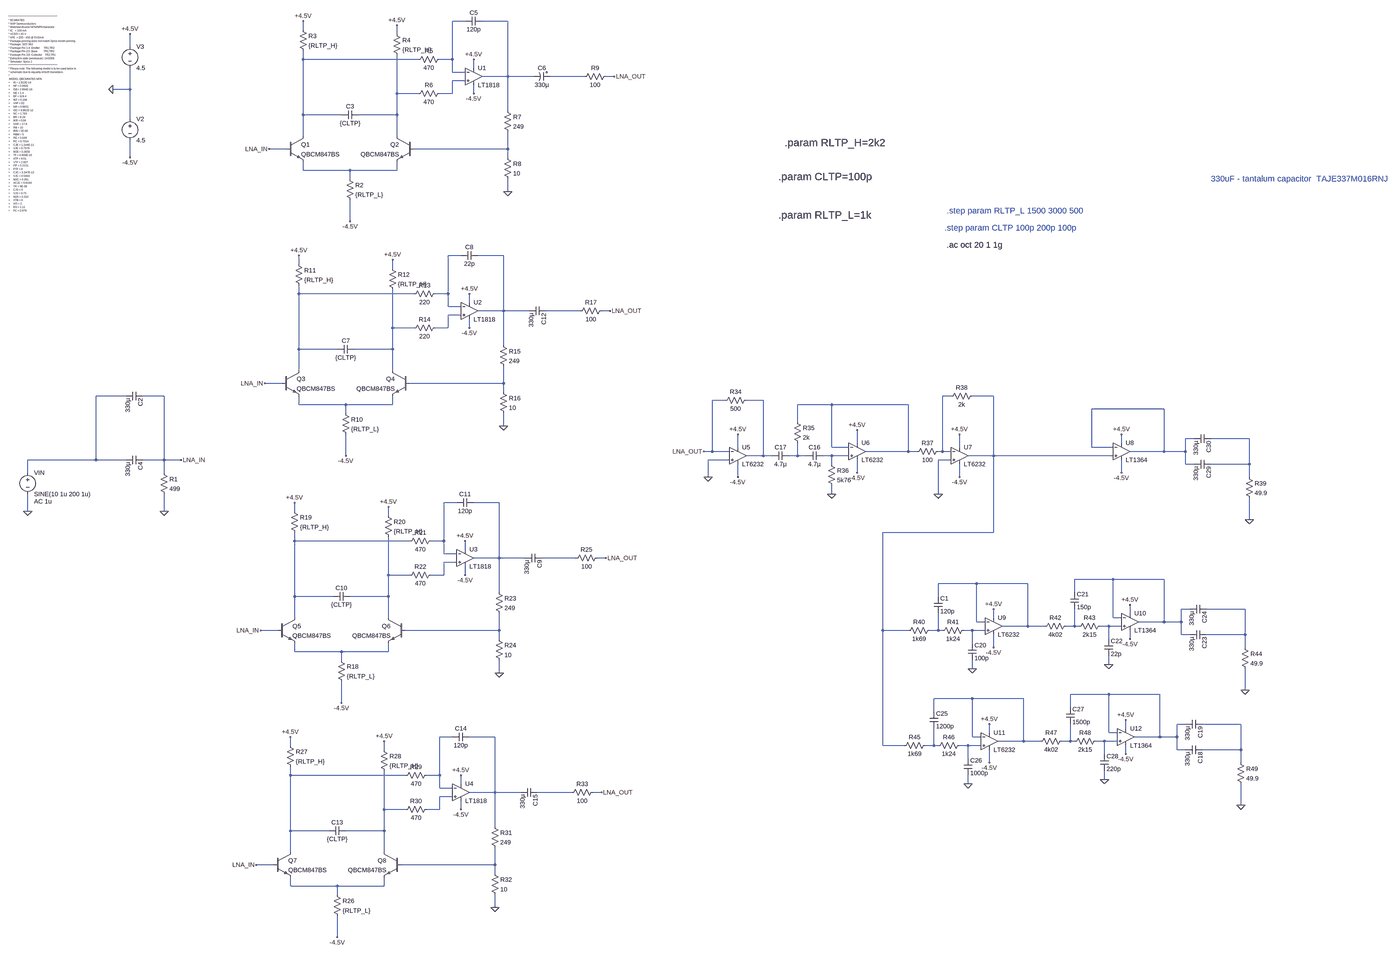
[diagram p0: schematic inzynierka.asc, whole sheet]
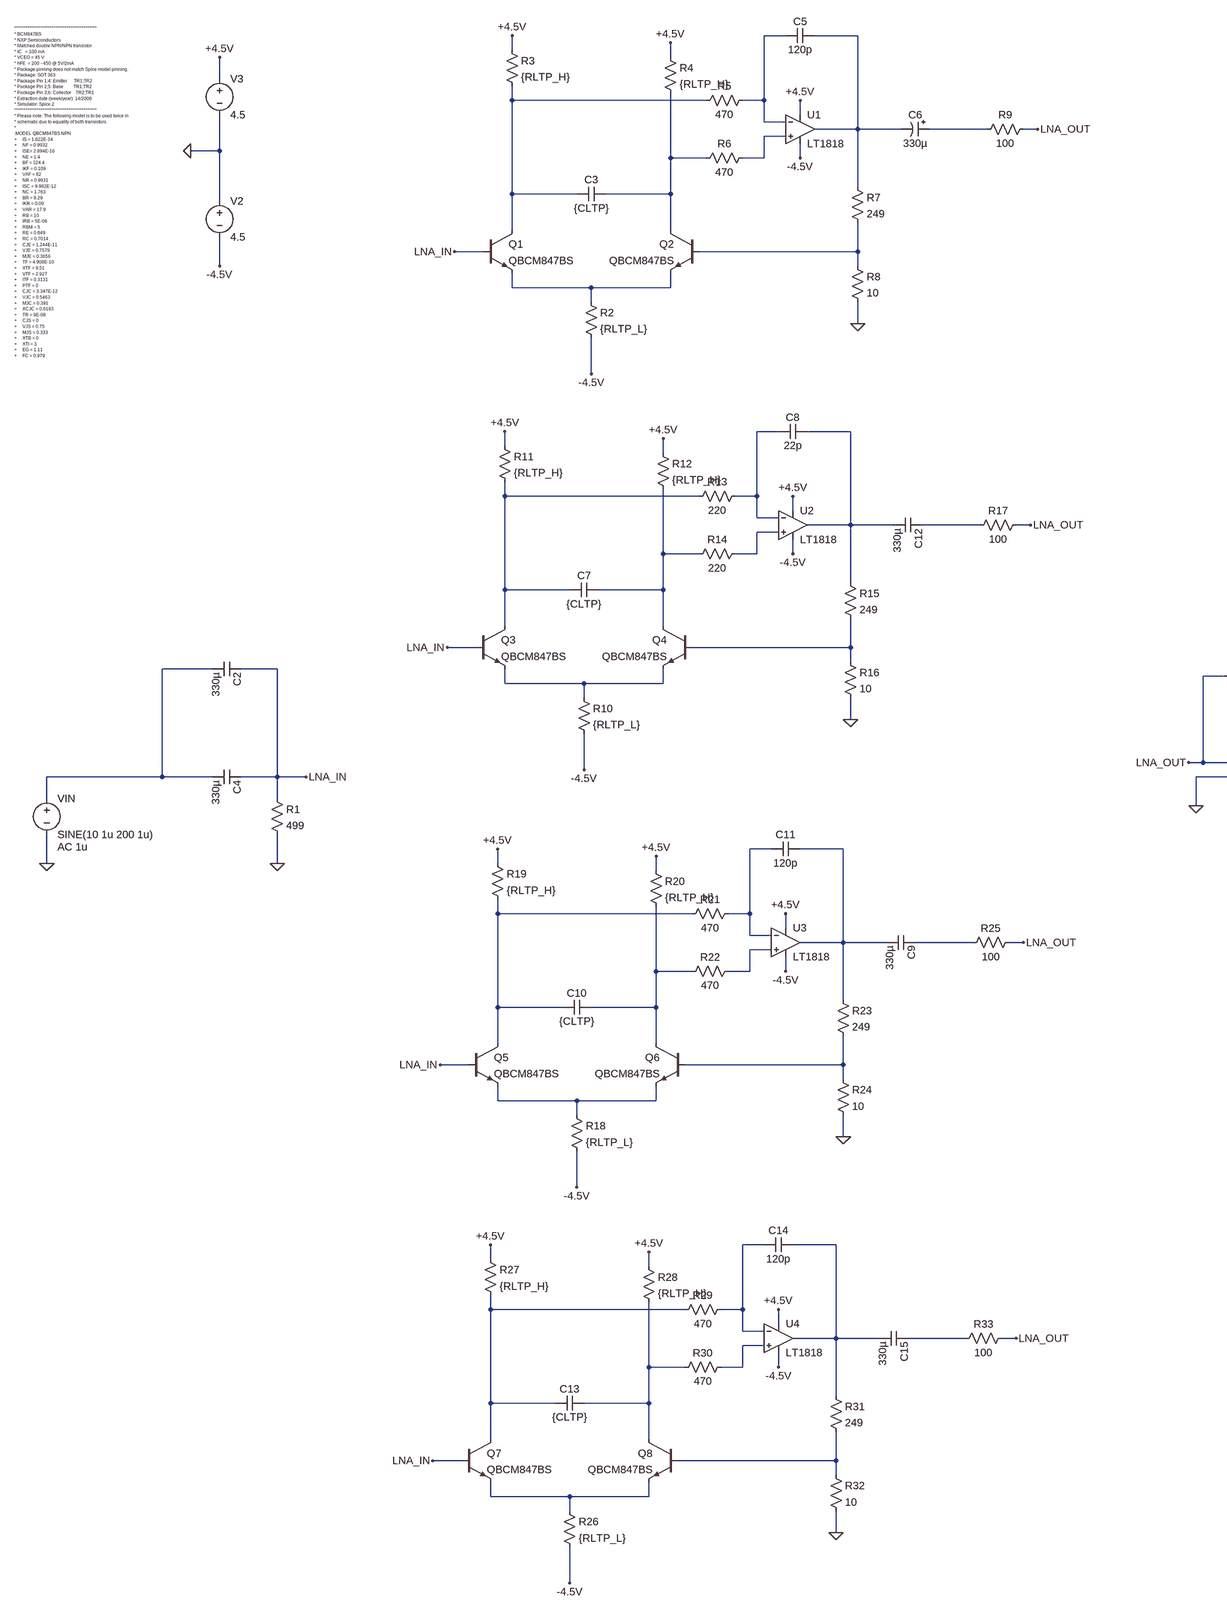
[diagram p1: schematic inzynierka.asc, part, row 1 of 1, column 1 of 2]
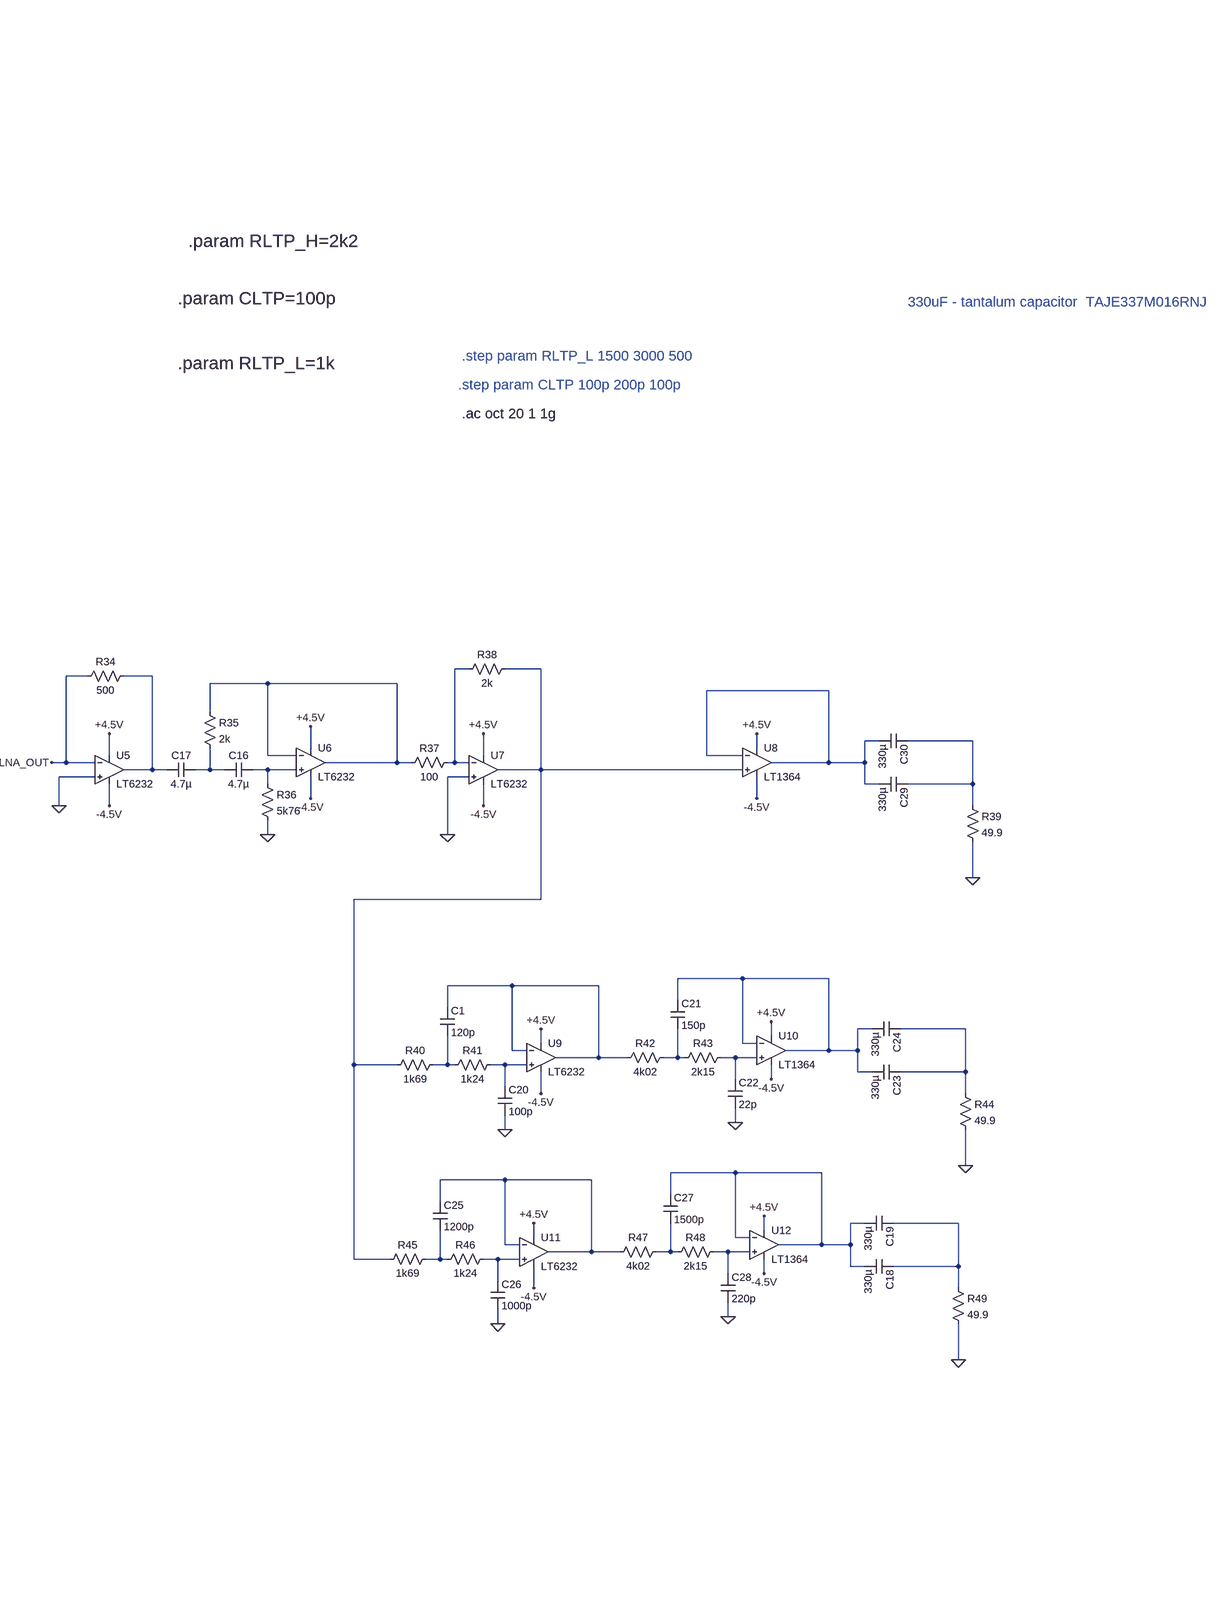
[diagram p2: schematic inzynierka.asc, part, row 1 of 1, column 2 of 2]
inzynierka.asc, the LTspice schematic file:
Version 4
SHEET 1 4992 2584
WIRE 1424 -960 1376 -960
WIRE 1584 -960 1488 -960
WIRE 816 -928 816 -960
WIRE 1168 -912 1168 -944
WIRE -144 -864 -144 -912
WIRE 816 -816 816 -848
WIRE 1248 -816 816 -816
WIRE 1376 -816 1376 -960
WIRE 1376 -816 1328 -816
WIRE 1456 -784 1456 -816
WIRE 1376 -768 1376 -816
WIRE 1424 -768 1376 -768
WIRE 1584 -752 1584 -960
WIRE 1584 -752 1488 -752
WIRE 1680 -752 1584 -752
WIRE 1872 -752 1744 -752
WIRE 1984 -752 1952 -752
WIRE 1424 -736 1376 -736
WIRE -144 -704 -144 -784
WIRE -144 -704 -208 -704
WIRE 1168 -688 1168 -832
WIRE 1248 -688 1168 -688
WIRE 1376 -688 1376 -736
WIRE 1376 -688 1328 -688
WIRE 1456 -688 1456 -720
WIRE 1584 -624 1584 -752
WIRE 816 -608 816 -816
WIRE 960 -608 816 -608
WIRE 1168 -608 1168 -688
WIRE 1168 -608 1024 -608
WIRE -144 -592 -144 -704
WIRE 816 -528 816 -608
WIRE 1168 -528 1168 -608
WIRE 752 -480 688 -480
WIRE 1584 -480 1584 -544
WIRE 1584 -480 1232 -480
WIRE -144 -448 -144 -512
WIRE 1584 -448 1584 -480
WIRE 816 -400 816 -432
WIRE 992 -400 816 -400
WIRE 1168 -400 1168 -432
WIRE 1168 -400 992 -400
WIRE 992 -368 992 -400
WIRE 1584 -320 1584 -368
WIRE 992 -208 992 -288
WIRE 1408 -80 1360 -80
WIRE 1568 -80 1472 -80
WIRE 800 -48 800 -80
WIRE 1152 -32 1152 -64
WIRE 800 64 800 32
WIRE 1232 64 800 64
WIRE 1360 64 1360 -80
WIRE 1360 64 1312 64
WIRE 1440 96 1440 64
WIRE 1360 112 1360 64
WIRE 1408 112 1360 112
WIRE 1568 128 1568 -80
WIRE 1568 128 1472 128
WIRE 1664 128 1568 128
WIRE 1856 128 1728 128
WIRE 1968 128 1936 128
WIRE 1408 144 1360 144
WIRE 1152 192 1152 48
WIRE 1232 192 1152 192
WIRE 1360 192 1360 144
WIRE 1360 192 1312 192
WIRE 1440 192 1440 160
WIRE 1568 256 1568 128
WIRE 800 272 800 64
WIRE 944 272 800 272
WIRE 1152 272 1152 192
WIRE 1152 272 1008 272
WIRE 800 352 800 272
WIRE 1152 352 1152 272
WIRE 736 400 672 400
WIRE 1568 400 1568 336
WIRE 1568 400 1216 400
WIRE 1568 432 1568 400
WIRE -160 448 -272 448
WIRE -16 448 -96 448
WIRE 3296 448 3264 448
WIRE 3456 448 3376 448
WIRE 2448 464 2400 464
WIRE 2592 464 2528 464
WIRE 800 480 800 448
WIRE 976 480 800 480
WIRE 1152 480 1152 448
WIRE 1152 480 976 480
WIRE 2848 480 2720 480
WIRE 3136 480 2848 480
WIRE 4096 496 3824 496
WIRE 976 512 976 480
WIRE 2720 544 2720 480
WIRE 1568 560 1568 512
WIRE 4208 608 4176 608
WIRE 4416 608 4272 608
WIRE 2944 624 2944 576
WIRE 3936 624 3936 592
WIRE 2496 640 2496 592
WIRE 2848 640 2848 480
WIRE 2912 640 2848 640
WIRE 3328 640 3328 592
WIRE 3824 640 3824 496
WIRE 3904 640 3824 640
WIRE 2400 656 2400 464
WIRE 2400 656 2368 656
WIRE 2464 656 2400 656
WIRE 3136 656 3136 480
WIRE 3136 656 2976 656
WIRE 3168 656 3136 656
WIRE 3264 656 3264 448
WIRE 3264 656 3248 656
WIRE 3296 656 3264 656
WIRE 4096 656 4096 496
WIRE 4096 656 3968 656
WIRE 4176 656 4176 608
WIRE 4176 656 4096 656
WIRE 976 672 976 592
WIRE 2592 672 2592 464
WIRE 2592 672 2528 672
WIRE 2624 672 2592 672
WIRE 2720 672 2720 624
WIRE 2720 672 2688 672
WIRE 2752 672 2720 672
WIRE 2848 672 2816 672
WIRE 2912 672 2848 672
WIRE 3456 672 3456 448
WIRE 3456 672 3360 672
WIRE 3904 672 3456 672
WIRE -272 688 -272 448
WIRE -272 688 -528 688
WIRE -160 688 -272 688
WIRE -16 688 -16 448
WIRE -16 688 -96 688
WIRE 48 688 -16 688
WIRE 2464 688 2384 688
WIRE 3296 688 3248 688
WIRE 2848 704 2848 672
WIRE 4176 704 4176 656
WIRE 4208 704 4176 704
WIRE 4416 704 4416 608
WIRE 4416 704 4272 704
WIRE -528 736 -528 688
WIRE -16 736 -16 688
WIRE 2944 736 2944 688
WIRE 3936 736 3936 688
WIRE 2384 752 2384 688
WIRE 2496 752 2496 704
WIRE 3328 752 3328 704
WIRE 4416 752 4416 704
WIRE 2848 816 2848 784
WIRE 3248 816 3248 688
WIRE 1392 848 1344 848
WIRE 1552 848 1456 848
WIRE -528 880 -528 816
WIRE -16 880 -16 816
WIRE 784 880 784 848
WIRE 1136 896 1136 864
WIRE 4416 912 4416 832
WIRE 3456 960 3456 672
WIRE 3456 960 3040 960
WIRE 784 992 784 960
WIRE 1216 992 784 992
WIRE 1344 992 1344 848
WIRE 1344 992 1296 992
WIRE 1424 1024 1424 992
WIRE 1344 1040 1344 992
WIRE 1392 1040 1344 1040
WIRE 1552 1056 1552 848
WIRE 1552 1056 1456 1056
WIRE 1648 1056 1552 1056
WIRE 1840 1056 1712 1056
WIRE 1952 1056 1920 1056
WIRE 1392 1072 1344 1072
WIRE 1136 1120 1136 976
WIRE 1216 1120 1136 1120
WIRE 1344 1120 1344 1072
WIRE 1344 1120 1296 1120
WIRE 1424 1120 1424 1088
WIRE 3904 1136 3760 1136
WIRE 4096 1136 3904 1136
WIRE 3392 1152 3248 1152
WIRE 3584 1152 3392 1152
WIRE 1552 1184 1552 1056
WIRE 3760 1184 3760 1136
WIRE 784 1200 784 992
WIRE 928 1200 784 1200
WIRE 1136 1200 1136 1120
WIRE 1136 1200 992 1200
WIRE 3248 1200 3248 1152
WIRE 4192 1248 4160 1248
WIRE 4400 1248 4256 1248
WIRE 3968 1264 3968 1232
WIRE 784 1280 784 1200
WIRE 1136 1280 1136 1200
WIRE 3456 1280 3456 1248
WIRE 3904 1280 3904 1136
WIRE 3936 1280 3904 1280
WIRE 3392 1296 3392 1152
WIRE 3424 1296 3392 1296
WIRE 4096 1296 4096 1136
WIRE 4096 1296 4000 1296
WIRE 4160 1296 4160 1248
WIRE 4160 1296 4096 1296
WIRE 3584 1312 3584 1152
WIRE 3584 1312 3488 1312
WIRE 3648 1312 3584 1312
WIRE 3760 1312 3760 1248
WIRE 3760 1312 3728 1312
WIRE 3776 1312 3760 1312
WIRE 3888 1312 3856 1312
WIRE 3936 1312 3888 1312
WIRE 720 1328 656 1328
WIRE 1552 1328 1552 1264
WIRE 1552 1328 1200 1328
WIRE 3040 1328 3040 960
WIRE 3136 1328 3040 1328
WIRE 3248 1328 3248 1264
WIRE 3248 1328 3216 1328
WIRE 3264 1328 3248 1328
WIRE 3376 1328 3344 1328
WIRE 3424 1328 3376 1328
WIRE 4160 1344 4160 1296
WIRE 4192 1344 4160 1344
WIRE 4400 1344 4400 1248
WIRE 4400 1344 4256 1344
WIRE 1552 1360 1552 1328
WIRE 3888 1360 3888 1312
WIRE 3968 1360 3968 1328
WIRE 3376 1376 3376 1328
WIRE 3456 1392 3456 1344
WIRE 4400 1392 4400 1344
WIRE 784 1408 784 1376
WIRE 960 1408 784 1408
WIRE 1136 1408 1136 1376
WIRE 1136 1408 960 1408
WIRE 960 1440 960 1408
WIRE 3888 1456 3888 1424
WIRE 3376 1472 3376 1440
WIRE 1552 1488 1552 1440
WIRE 4400 1552 4400 1472
WIRE 3888 1568 3744 1568
WIRE 4080 1568 3888 1568
WIRE 3376 1584 3232 1584
WIRE 3568 1584 3376 1584
WIRE 960 1600 960 1520
WIRE 3744 1616 3744 1568
WIRE 3232 1632 3232 1584
WIRE 4176 1680 4144 1680
WIRE 4384 1680 4240 1680
WIRE 3952 1696 3952 1664
WIRE 3440 1712 3440 1680
WIRE 3888 1712 3888 1568
WIRE 3920 1712 3888 1712
WIRE 1376 1728 1328 1728
WIRE 1536 1728 1440 1728
WIRE 3376 1728 3376 1584
WIRE 3408 1728 3376 1728
WIRE 4080 1728 4080 1568
WIRE 4080 1728 3984 1728
WIRE 4144 1728 4144 1680
WIRE 4144 1728 4080 1728
WIRE 3568 1744 3568 1584
WIRE 3568 1744 3472 1744
WIRE 3632 1744 3568 1744
WIRE 3744 1744 3744 1680
WIRE 3744 1744 3712 1744
WIRE 3760 1744 3744 1744
WIRE 3872 1744 3840 1744
WIRE 3920 1744 3872 1744
WIRE 768 1760 768 1728
WIRE 3040 1760 3040 1328
WIRE 3120 1760 3040 1760
WIRE 3232 1760 3232 1696
WIRE 3232 1760 3200 1760
WIRE 3248 1760 3232 1760
WIRE 3360 1760 3328 1760
WIRE 3408 1760 3360 1760
WIRE 1120 1776 1120 1744
WIRE 4144 1776 4144 1728
WIRE 4176 1776 4144 1776
WIRE 4384 1776 4384 1680
WIRE 4384 1776 4240 1776
WIRE 3872 1792 3872 1744
WIRE 3952 1792 3952 1760
WIRE 3360 1808 3360 1760
WIRE 3440 1824 3440 1776
WIRE 4384 1824 4384 1776
WIRE 768 1872 768 1840
WIRE 1200 1872 768 1872
WIRE 1328 1872 1328 1728
WIRE 1328 1872 1280 1872
WIRE 3872 1888 3872 1856
WIRE 1408 1904 1408 1872
WIRE 3360 1904 3360 1872
WIRE 1328 1920 1328 1872
WIRE 1376 1920 1328 1920
WIRE 1536 1936 1536 1728
WIRE 1536 1936 1440 1936
WIRE 1632 1936 1536 1936
WIRE 1824 1936 1696 1936
WIRE 1936 1936 1904 1936
WIRE 1376 1952 1328 1952
WIRE 4384 1984 4384 1904
WIRE 1120 2000 1120 1856
WIRE 1200 2000 1120 2000
WIRE 1328 2000 1328 1952
WIRE 1328 2000 1280 2000
WIRE 1408 2000 1408 1968
WIRE 1536 2064 1536 1936
WIRE 768 2080 768 1872
WIRE 912 2080 768 2080
WIRE 1120 2080 1120 2000
WIRE 1120 2080 976 2080
WIRE 768 2160 768 2080
WIRE 1120 2160 1120 2080
WIRE 704 2208 640 2208
WIRE 1536 2208 1536 2144
WIRE 1536 2208 1184 2208
WIRE 1536 2240 1536 2208
WIRE 768 2288 768 2256
WIRE 944 2288 768 2288
WIRE 1120 2288 1120 2256
WIRE 1120 2288 944 2288
WIRE 944 2320 944 2288
WIRE 1536 2368 1536 2320
WIRE 944 2480 944 2400
FLAG -528 880 0
FLAG -16 880 0
FLAG -208 -704 0
FLAG -144 -912 +4.5V
FLAG -144 -448 -4.5V
FLAG 992 -208 -4.5V
FLAG 816 -960 +4.5V
FLAG 1168 -944 +4.5V
FLAG 1456 -816 +4.5V
FLAG 1456 -688 -4.5V
FLAG 1584 -320 0
FLAG 1984 -752 LNA_OUT
FLAG 688 -480 LNA_IN
FLAG 48 688 LNA_IN
FLAG 976 672 -4.5V
FLAG 800 -80 +4.5V
FLAG 1152 -64 +4.5V
FLAG 1440 64 +4.5V
FLAG 1440 192 -4.5V
FLAG 1568 560 0
FLAG 1968 128 LNA_OUT
FLAG 672 400 LNA_IN
FLAG 960 1600 -4.5V
FLAG 784 848 +4.5V
FLAG 1136 864 +4.5V
FLAG 1424 992 +4.5V
FLAG 1424 1120 -4.5V
FLAG 1552 1488 0
FLAG 1952 1056 LNA_OUT
FLAG 656 1328 LNA_IN
FLAG 944 2480 -4.5V
FLAG 768 1728 +4.5V
FLAG 1120 1744 +4.5V
FLAG 1408 1872 +4.5V
FLAG 1408 2000 -4.5V
FLAG 1536 2368 0
FLAG 1936 1936 LNA_OUT
FLAG 640 2208 LNA_IN
FLAG 2368 656 LNA_OUT
FLAG 2496 592 +4.5V
FLAG 2496 752 -4.5V
FLAG 2944 576 +4.5V
FLAG 2944 736 -4.5V
FLAG 2384 752 0
FLAG 2848 816 0
FLAG 3328 592 +4.5V
FLAG 3328 752 -4.5V
FLAG 3248 816 0
FLAG 3936 736 -4.5V
FLAG 3936 592 +4.5V
FLAG 4416 912 0
FLAG 3376 1472 0
FLAG 3888 1456 0
FLAG 4400 1552 0
FLAG 3456 1248 +4.5V
FLAG 3968 1232 +4.5V
FLAG 3968 1360 -4.5V
FLAG 3456 1392 -4.5V
FLAG 3360 1904 0
FLAG 3872 1888 0
FLAG 4384 1984 0
FLAG 3440 1680 +4.5V
FLAG 3952 1664 +4.5V
FLAG 3952 1792 -4.5V
FLAG 3440 1824 -4.5V
SYMBOL voltage -528 720 R0
WINDOW 123 24 124 Left 2
WINDOW 39 0 0 Left 0
SYMATTR Value2 AC 1u
SYMATTR InstName VIN
SYMATTR Value SINE(10 1u 200 1u)
SYMBOL res -32 720 R0
SYMATTR InstName R1
SYMATTR Value 499
SYMATTR SpiceLine tol=1 pwr=0.1
SYMBOL npn 752 -528 R0
SYMATTR InstName Q1
SYMATTR Value QBCM847BS
SYMBOL npn 1232 -528 M0
SYMATTR InstName Q2
SYMATTR Value QBCM847BS
SYMBOL res 976 -384 R0
SYMATTR InstName R2
SYMATTR Value {RLTP_L}
SYMATTR SpiceLine tol=1 pwr=0.1
SYMBOL cap 1024 -624 R90
WINDOW 0 0 32 VBottom 2
WINDOW 3 32 32 VTop 2
SYMATTR InstName C3
SYMATTR Value {CLTP}
SYMATTR SpiceLine V=50 Irms=0 Rser=0 Lser=0 mfg="Murata" pn="GCM1555C1H331JA16" type="C0G"
SYMBOL res 800 -944 R0
SYMATTR InstName R3
SYMATTR Value {RLTP_H}
SYMATTR SpiceLine tol=1 pwr=0.1
SYMBOL res 1152 -928 R0
SYMATTR InstName R4
SYMATTR Value {RLTP_H}
SYMATTR SpiceLine tol=1 pwr=0.1
SYMBOL voltage -144 -608 R0
WINDOW 123 0 0 Left 0
WINDOW 39 0 0 Left 0
SYMATTR InstName V2
SYMATTR Value 4.5
SYMBOL voltage -144 -880 R0
WINDOW 123 0 0 Left 0
WINDOW 39 0 0 Left 0
SYMATTR InstName V3
SYMATTR Value 4.5
SYMBOL Opamps\\LT1818 1456 -752 R0
SYMATTR InstName U1
SYMBOL res 1344 -832 R90
WINDOW 0 0 56 VBottom 2
WINDOW 3 32 56 VTop 2
SYMATTR InstName R5
SYMATTR Value 470
SYMATTR SpiceLine tol=1 pwr=0.1
SYMBOL res 1344 -704 R90
WINDOW 0 0 56 VBottom 2
WINDOW 3 32 56 VTop 2
SYMATTR InstName R6
SYMATTR Value 470
SYMATTR SpiceLine tol=1 pwr=0.1
SYMBOL cap 1488 -976 R90
WINDOW 0 0 32 VBottom 2
WINDOW 3 32 32 VTop 2
SYMATTR InstName C5
SYMATTR Value 120p
SYMATTR SpiceLine V=50 Irms=0 Rser=0 Lser=0 mfg="Murata" pn="GRM0335C1H121JA01" type="C0G"
SYMBOL res 1568 -640 R0
SYMATTR InstName R7
SYMATTR Value 249
SYMATTR SpiceLine tol=1 pwr=0.1
SYMBOL res 1568 -464 R0
SYMATTR InstName R8
SYMATTR Value 10
SYMATTR SpiceLine tol=1 pwr=0.1
SYMBOL polcap 1744 -768 R90
WINDOW 0 0 32 VBottom 2
WINDOW 3 32 32 VTop 2
SYMATTR InstName C6
SYMATTR Value 330µ
SYMATTR Description Capacitor
SYMATTR Type cap
SYMATTR SpiceLine V=16 Irms=2.22261 Rser=0.05 Lser=0 mfg="KEMET" pn="T521X337M016ATE050" type="Tantalum"
SYMBOL res 1968 -768 R90
WINDOW 0 0 56 VBottom 2
WINDOW 3 32 56 VTop 2
SYMATTR InstName R9
SYMATTR Value 100
SYMATTR SpiceLine tol=1 pwr=0.1
SYMBOL npn 736 352 R0
SYMATTR InstName Q3
SYMATTR Value QBCM847BS
SYMBOL npn 1216 352 M0
SYMATTR InstName Q4
SYMATTR Value QBCM847BS
SYMBOL res 960 496 R0
SYMATTR InstName R10
SYMATTR Value {RLTP_L}
SYMATTR SpiceLine tol=1 pwr=0.1
SYMBOL cap 1008 256 R90
WINDOW 0 0 32 VBottom 2
WINDOW 3 32 32 VTop 2
SYMATTR InstName C7
SYMATTR Value {CLTP}
SYMATTR SpiceLine V=50 Irms=0 Rser=0 Lser=0
SYMBOL res 784 -64 R0
SYMATTR InstName R11
SYMATTR Value {RLTP_H}
SYMATTR SpiceLine tol=1 pwr=0.1
SYMBOL res 1136 -48 R0
SYMATTR InstName R12
SYMATTR Value {RLTP_H}
SYMATTR SpiceLine tol=1 pwr=0.1
SYMBOL Opamps\\LT1818 1440 128 R0
SYMATTR InstName U2
SYMBOL res 1328 48 R90
WINDOW 0 0 56 VBottom 2
WINDOW 3 32 56 VTop 2
SYMATTR InstName R13
SYMATTR Value 220
SYMATTR SpiceLine tol=1 pwr=0.1
SYMBOL res 1328 176 R90
WINDOW 0 0 56 VBottom 2
WINDOW 3 32 56 VTop 2
SYMATTR InstName R14
SYMATTR Value 220
SYMATTR SpiceLine tol=1 pwr=0.1
SYMBOL cap 1472 -96 R90
WINDOW 0 0 32 VBottom 2
WINDOW 3 32 32 VTop 2
SYMATTR InstName C8
SYMATTR Value 22p
SYMATTR SpiceLine V=50 Irms=0 Rser=0 Lser=0
SYMBOL res 1552 240 R0
SYMATTR InstName R15
SYMATTR Value 249
SYMATTR SpiceLine tol=1 pwr=0.1
SYMBOL res 1552 416 R0
SYMATTR InstName R16
SYMATTR Value 10
SYMATTR SpiceLine tol=1 pwr=0.1
SYMBOL res 1952 112 R90
WINDOW 0 0 56 VBottom 2
WINDOW 3 32 56 VTop 2
SYMATTR InstName R17
SYMATTR Value 100
SYMATTR SpiceLine tol=1 pwr=0.1
SYMBOL npn 720 1280 R0
SYMATTR InstName Q5
SYMATTR Value QBCM847BS
SYMBOL npn 1200 1280 M0
SYMATTR InstName Q6
SYMATTR Value QBCM847BS
SYMBOL res 944 1424 R0
SYMATTR InstName R18
SYMATTR Value {RLTP_L}
SYMATTR SpiceLine tol=1 pwr=0.1
SYMBOL cap 992 1184 R90
WINDOW 0 0 32 VBottom 2
WINDOW 3 32 32 VTop 2
SYMATTR InstName C10
SYMATTR Value {CLTP}
SYMATTR SpiceLine V=50 Irms=0 Rser=0 Lser=0 mfg="Murata" pn="GCM1555C1H331JA16" type="C0G"
SYMBOL res 768 864 R0
SYMATTR InstName R19
SYMATTR Value {RLTP_H}
SYMATTR SpiceLine tol=1 pwr=0.1
SYMBOL res 1120 880 R0
SYMATTR InstName R20
SYMATTR Value {RLTP_H}
SYMATTR SpiceLine tol=1 pwr=0.1
SYMBOL Opamps\\LT1818 1424 1056 R0
SYMATTR InstName U3
SYMBOL res 1312 976 R90
WINDOW 0 0 56 VBottom 2
WINDOW 3 32 56 VTop 2
SYMATTR InstName R21
SYMATTR Value 470
SYMATTR SpiceLine tol=1 pwr=0.1
SYMBOL res 1312 1104 R90
WINDOW 0 0 56 VBottom 2
WINDOW 3 32 56 VTop 2
SYMATTR InstName R22
SYMATTR Value 470
SYMATTR SpiceLine tol=1 pwr=0.1
SYMBOL cap 1456 832 R90
WINDOW 0 0 32 VBottom 2
WINDOW 3 32 32 VTop 2
SYMATTR InstName C11
SYMATTR Value 120p
SYMATTR SpiceLine V=50 Irms=0 Rser=0 Lser=0 mfg="Murata" pn="GRM0335C1H121JA01" type="C0G"
SYMBOL res 1536 1168 R0
SYMATTR InstName R23
SYMATTR Value 249
SYMATTR SpiceLine tol=1 pwr=0.1
SYMBOL res 1536 1344 R0
SYMATTR InstName R24
SYMATTR Value 10
SYMATTR SpiceLine tol=1 pwr=0.1
SYMBOL res 1936 1040 R90
WINDOW 0 0 56 VBottom 2
WINDOW 3 32 56 VTop 2
SYMATTR InstName R25
SYMATTR Value 100
SYMATTR SpiceLine tol=1 pwr=0.1
SYMBOL npn 704 2160 R0
SYMATTR InstName Q7
SYMATTR Value QBCM847BS
SYMBOL npn 1184 2160 M0
SYMATTR InstName Q8
SYMATTR Value QBCM847BS
SYMBOL res 928 2304 R0
SYMATTR InstName R26
SYMATTR Value {RLTP_L}
SYMATTR SpiceLine tol=1 pwr=0.1
SYMBOL cap 976 2064 R90
WINDOW 0 0 32 VBottom 2
WINDOW 3 32 32 VTop 2
SYMATTR InstName C13
SYMATTR Value {CLTP}
SYMATTR SpiceLine V=50 Irms=0 Rser=0 Lser=0 mfg="Murata" pn="GCM1555C1H331JA16" type="C0G"
SYMBOL res 752 1744 R0
SYMATTR InstName R27
SYMATTR Value {RLTP_H}
SYMATTR SpiceLine tol=1 pwr=0.1
SYMBOL res 1104 1760 R0
SYMATTR InstName R28
SYMATTR Value {RLTP_H}
SYMATTR SpiceLine tol=1 pwr=0.1
SYMBOL Opamps\\LT1818 1408 1936 R0
SYMATTR InstName U4
SYMBOL res 1296 1856 R90
WINDOW 0 0 56 VBottom 2
WINDOW 3 32 56 VTop 2
SYMATTR InstName R29
SYMATTR Value 470
SYMATTR SpiceLine tol=1 pwr=0.1
SYMBOL res 1296 1984 R90
WINDOW 0 0 56 VBottom 2
WINDOW 3 32 56 VTop 2
SYMATTR InstName R30
SYMATTR Value 470
SYMATTR SpiceLine tol=1 pwr=0.1
SYMBOL cap 1440 1712 R90
WINDOW 0 0 32 VBottom 2
WINDOW 3 32 32 VTop 2
SYMATTR InstName C14
SYMATTR Value 120p
SYMATTR SpiceLine V=50 Irms=0 Rser=0 Lser=0 mfg="Murata" pn="GRM0335C1H121JA01" type="C0G"
SYMBOL res 1520 2048 R0
SYMATTR InstName R31
SYMATTR Value 249
SYMATTR SpiceLine tol=1 pwr=0.1
SYMBOL res 1520 2224 R0
SYMATTR InstName R32
SYMATTR Value 10
SYMATTR SpiceLine tol=1 pwr=0.1
SYMBOL res 1920 1920 R90
WINDOW 0 0 56 VBottom 2
WINDOW 3 32 56 VTop 2
SYMATTR InstName R33
SYMATTR Value 100
SYMATTR SpiceLine tol=1 pwr=0.1
SYMBOL Opamps\\LT6232 2496 672 R0
SYMATTR InstName U5
SYMBOL Opamps\\LT6232 2944 656 R0
SYMATTR InstName U6
SYMBOL res 2544 448 R90
WINDOW 0 0 56 VBottom 2
WINDOW 3 32 56 VTop 2
SYMATTR InstName R34
SYMATTR Value 500
SYMATTR SpiceLine tol=1 pwr=0.1
SYMBOL cap 2688 656 R90
WINDOW 0 0 32 VBottom 2
WINDOW 3 32 32 VTop 2
SYMATTR InstName C17
SYMATTR Value 4.7µ
SYMATTR SpiceLine V=16 Irms=0 Rser=0 Lser=0 mfg="Murata" pn="GCM31CR71C475MA37" type="X7R"
SYMBOL cap 2816 656 R90
WINDOW 0 0 32 VBottom 2
WINDOW 3 32 32 VTop 2
SYMATTR InstName C16
SYMATTR Value 4.7µ
SYMATTR SpiceLine V=16 Irms=0 Rser=0 Lser=0 mfg="Murata" pn="GCM31CR71C475MA37" type="X7R"
SYMBOL res 2704 528 R0
SYMATTR InstName R35
SYMATTR Value 2k
SYMBOL res 2832 688 R0
SYMATTR InstName R36
SYMATTR Value 5k76
SYMBOL Opamps\\LT6232 3328 672 R0
SYMATTR InstName U7
SYMBOL res 3264 640 R90
WINDOW 0 0 56 VBottom 2
WINDOW 3 32 56 VTop 2
SYMATTR InstName R37
SYMATTR Value 100
SYMATTR SpiceLine tol=1 pwr=0.1
SYMBOL Opamps\\LT1364 3936 592 R0
SYMATTR InstName U8
SYMBOL res 4400 736 R0
SYMATTR InstName R39
SYMATTR Value 49.9
SYMATTR SpiceLine tol=1 pwr=0.1
SYMBOL res 3392 432 R90
WINDOW 0 0 56 VBottom 2
WINDOW 3 32 56 VTop 2
SYMATTR InstName R38
SYMATTR Value 2k
SYMBOL res 3232 1312 R90
WINDOW 0 0 56 VBottom 2
WINDOW 3 32 56 VTop 2
SYMATTR InstName R40
SYMATTR Value 1k69
SYMBOL res 3360 1312 R90
WINDOW 0 0 56 VBottom 2
WINDOW 3 32 56 VTop 2
SYMATTR InstName R41
SYMATTR Value 1k24
SYMBOL cap 3232 1200 R0
SYMATTR InstName C1
SYMATTR Value 120p
SYMBOL Opamps\\LT6232 3456 1312 R0
SYMATTR InstName U9
SYMBOL cap 3360 1376 R0
SYMATTR InstName C20
SYMATTR Value 100p
SYMBOL res 3744 1296 R90
WINDOW 0 0 56 VBottom 2
WINDOW 3 32 56 VTop 2
SYMATTR InstName R42
SYMATTR Value 4k02
SYMBOL res 3872 1296 R90
WINDOW 0 0 56 VBottom 2
WINDOW 3 32 56 VTop 2
SYMATTR InstName R43
SYMATTR Value 2k15
SYMBOL cap 3744 1184 R0
SYMATTR InstName C21
SYMATTR Value 150p
SYMBOL cap 3872 1360 R0
SYMATTR InstName C22
SYMATTR Value 22p
SYMBOL res 4384 1376 R0
SYMATTR InstName R44
SYMATTR Value 49.9
SYMATTR SpiceLine tol=1 pwr=0.1
SYMBOL Opamps\\LT1364 3968 1232 R0
SYMATTR InstName U10
SYMBOL res 3216 1744 R90
WINDOW 0 0 56 VBottom 2
WINDOW 3 32 56 VTop 2
SYMATTR InstName R45
SYMATTR Value 1k69
SYMBOL res 3344 1744 R90
WINDOW 0 0 56 VBottom 2
WINDOW 3 32 56 VTop 2
SYMATTR InstName R46
SYMATTR Value 1k24
SYMBOL cap 3216 1632 R0
SYMATTR InstName C25
SYMATTR Value 1200p
SYMBOL Opamps\\LT6232 3440 1744 R0
SYMATTR InstName U11
SYMBOL cap 3344 1808 R0
SYMATTR InstName C26
SYMATTR Value 1000p
SYMBOL res 3728 1728 R90
WINDOW 0 0 56 VBottom 2
WINDOW 3 32 56 VTop 2
SYMATTR InstName R47
SYMATTR Value 4k02
SYMBOL res 3856 1728 R90
WINDOW 0 0 56 VBottom 2
WINDOW 3 32 56 VTop 2
SYMATTR InstName R48
SYMATTR Value 2k15
SYMBOL cap 3728 1616 R0
SYMATTR InstName C27
SYMATTR Value 1500p
SYMBOL cap 3856 1792 R0
SYMATTR InstName C28
SYMATTR Value 220p
SYMBOL res 4368 1808 R0
SYMATTR InstName R49
SYMATTR Value 49.9
SYMATTR SpiceLine tol=1 pwr=0.1
SYMBOL Opamps\\LT1364 3952 1664 R0
SYMATTR InstName U12
SYMBOL cap -96 432 R90
SYMATTR InstName C2
SYMATTR Value 330µ
SYMATTR SpiceLine V=16 Irms=0.578 Rser=0.4 Lser=2n Rpar=500k
SYMBOL cap -96 672 R90
SYMATTR InstName C4
SYMATTR Value 330µ
SYMATTR SpiceLine V=16 Irms=0.578 Rser=0.4 Lser=2n Rpar=500k
SYMBOL cap 1712 1040 R90
SYMATTR InstName C9
SYMATTR Value 330µ
SYMATTR SpiceLine V=16 Irms=0.578 Rser=0.4 Lser=2n Rpar=500k
SYMBOL cap 1728 112 R90
SYMATTR InstName C12
SYMATTR Value 330µ
SYMATTR SpiceLine V=16 Irms=0.578 Rser=0.4 Lser=2n Rpar=500k
SYMBOL cap 1696 1920 R90
SYMATTR InstName C15
SYMATTR Value 330µ
SYMATTR SpiceLine V=16 Irms=0.578 Rser=0.4 Lser=2n Rpar=500k
SYMBOL cap 4240 1760 R90
SYMATTR InstName C18
SYMATTR Value 330µ
SYMATTR SpiceLine V=16 Irms=0.578 Rser=0.4 Lser=2n Rpar=500k
SYMBOL cap 4240 1664 R90
SYMATTR InstName C19
SYMATTR Value 330µ
SYMATTR SpiceLine V=16 Irms=0.578 Rser=0.4 Lser=2n Rpar=500k
SYMBOL cap 4256 1328 R90
SYMATTR InstName C23
SYMATTR Value 330µ
SYMATTR SpiceLine V=16 Irms=0.578 Rser=0.4 Lser=2n Rpar=500k
SYMBOL cap 4256 1232 R90
SYMATTR InstName C24
SYMATTR Value 330µ
SYMATTR SpiceLine V=16 Irms=0.578 Rser=0.4 Lser=2n Rpar=500k
SYMBOL cap 4272 688 R90
SYMATTR InstName C29
SYMATTR Value 330µ
SYMATTR SpiceLine V=16 Irms=0.578 Rser=0.4 Lser=2n Rpar=500k
SYMBOL cap 4272 592 R90
SYMATTR InstName C30
SYMATTR Value 330µ
SYMATTR SpiceLine V=16 Irms=0.578 Rser=0.4 Lser=2n Rpar=500k
TEXT 3280 -120 Left 3 !.ac oct 20 1 1g
TEXT -600 -976 Left 0 !********************************************\n* BCM847BS\n* NXP Semiconductors\n* Matched double NPN/NPN transistor\n* IC   = 100 mA\n* VCEO = 45 V \n* hFE  = 200 - 450 @ 5V/2mA\n* Package pinning does not match Spice model pinning.\n* Package: SOT 363\n* Package Pin 1;4: Emitter      TR1;TR2\n* Package Pin 2;5: Base         TR1;TR2\n* Package Pin 3;6: Collector    TR2;TR1\n* Extraction date (week/year): 14/2006\n* Simulator: Spice 2        \n********************************************\n* Please note: The following model is to be used twice in \n* schematic due to equality of both transistors.\n*\n.MODEL QBCM847BS NPN\n+     IS = 1.822E-14 \n+     NF = 0.9932 \n+     ISE= 2.894E-16 \n+     NE = 1.4 \n+     BF = 324.4 \n+     IKF = 0.109 \n+     VAF = 82 \n+     NR = 0.9931 \n+     ISC = 9.982E-12 \n+     NC = 1.763 \n+     BR = 8.29 \n+     IKR = 0.09 \n+     VAR = 17.9 \n+     RB = 10 \n+     IRB = 5E-06 \n+     RBM = 5 \n+     RE = 0.649 \n+     RC = 0.7014 \n+     CJE = 1.244E-11 \n+     VJE = 0.7579 \n+     MJE = 0.3656 \n+     TF = 4.908E-10 \n+     XTF = 9.51 \n+     VTF = 2.927 \n+     ITF = 0.3131 \n+     PTF = 0 \n+     CJC = 3.347E-12 \n+     VJC = 0.5463 \n+     MJC = 0.391 \n+     XCJC = 0.6193 \n+     TR = 9E-08 \n+     CJS = 0 \n+     VJS = 0.75 \n+     MJS = 0.333 \n+     XTB = 0 \n+     XTI = 3 \n+     EG = 1.11 \n+     FC = 0.979
TEXT 2672 -504 Left 4 !.param RLTP_H=2k2
TEXT 2648 -232 Left 4 !.param RLTP_L=1k
TEXT 2648 -376 Left 4 !.param CLTP=100p
TEXT 3280 -248 Left 3 ;.step param RLTP_L 1500 3000 500
TEXT 3272 -184 Left 3 ;.step param CLTP 100p 200p 100p
TEXT 4272 -368 Left 3 ;330uF - tantalum capacitor  TAJE337M016RNJ

The netlist it stands for:
* inzynierka.asc
VIN N016 0 SINE(10 1u 200 1u) AC 1u
R1 LNA_IN 0 499 tol=1 pwr=0.1
Q1 N003 LNA_IN N008 0 QBCM847BS
Q2 N006 N007 N008 0 QBCM847BS
R2 N008 -4.5V {RLTP_L} tol=1 pwr=0.1
C3 N006 N003 {CLTP} V=50 Irms=0 Rser=0 Lser=0 mfg="Murata" pn="GCM1555C1H331JA16" type="C0G"
R3 +4.5V N003 {RLTP_H} tol=1 pwr=0.1
R4 +4.5V N006 {RLTP_H} tol=1 pwr=0.1
V2 0 -4.5V 4.5
V3 +4.5V 0 4.5
XU1 N005 N001 N002 +4.5V -4.5V LT1818  ; pins In+ In- OUT V+ V-
R5 N001 N003 470 tol=1 pwr=0.1
R6 N005 N006 470 tol=1 pwr=0.1
C5 N002 N001 120p V=50 Irms=0 Rser=0 Lser=0 mfg="Murata" pn="GRM0335C1H121JA01" type="C0G"
R7 N002 N007 249 tol=1 pwr=0.1
R8 N007 0 10 tol=1 pwr=0.1
C6 N004 N002 330µ V=16 Irms=2.22261 Rser=0.05 Lser=0 mfg="KEMET" pn="T521X337M016ATE050" type="Tantalum"
R9 LNA_OUT N004 100 tol=1 pwr=0.1
Q3 N011 LNA_IN N020 0 QBCM847BS
Q4 N014 N015 N020 0 QBCM847BS
R10 N020 -4.5V {RLTP_L} tol=1 pwr=0.1
C7 N014 N011 {CLTP} V=50 Irms=0 Rser=0 Lser=0
R11 +4.5V N011 {RLTP_H} tol=1 pwr=0.1
R12 +4.5V N014 {RLTP_H} tol=1 pwr=0.1
XU2 N013 N009 N010 +4.5V -4.5V LT1818  ; pins In+ In- OUT V+ V-
R13 N009 N011 220 tol=1 pwr=0.1
R14 N013 N014 220 tol=1 pwr=0.1
C8 N010 N009 22p V=50 Irms=0 Rser=0 Lser=0
R15 N010 N015 249 tol=1 pwr=0.1
R16 N015 0 10 tol=1 pwr=0.1
R17 LNA_OUT N012 100 tol=1 pwr=0.1
Q5 N028 LNA_IN N040 0 QBCM847BS
Q6 N031 N037 N040 0 QBCM847BS
R18 N040 -4.5V {RLTP_L} tol=1 pwr=0.1
C10 N031 N028 {CLTP} V=50 Irms=0 Rser=0 Lser=0 mfg="Murata" pn="GCM1555C1H331JA16" type="C0G"
R19 +4.5V N028 {RLTP_H} tol=1 pwr=0.1
R20 +4.5V N031 {RLTP_H} tol=1 pwr=0.1
XU3 N030 N026 N027 +4.5V -4.5V LT1818  ; pins In+ In- OUT V+ V-
R21 N026 N028 470 tol=1 pwr=0.1
R22 N030 N031 470 tol=1 pwr=0.1
C11 N027 N026 120p V=50 Irms=0 Rser=0 Lser=0 mfg="Murata" pn="GRM0335C1H121JA01" type="C0G"
R23 N027 N037 249 tol=1 pwr=0.1
R24 N037 0 10 tol=1 pwr=0.1
R25 LNA_OUT N029 100 tol=1 pwr=0.1
Q7 N050 LNA_IN N055 0 QBCM847BS
Q8 N053 N054 N055 0 QBCM847BS
R26 N055 -4.5V {RLTP_L} tol=1 pwr=0.1
C13 N053 N050 {CLTP} V=50 Irms=0 Rser=0 Lser=0 mfg="Murata" pn="GCM1555C1H331JA16" type="C0G"
R27 +4.5V N050 {RLTP_H} tol=1 pwr=0.1
R28 +4.5V N053 {RLTP_H} tol=1 pwr=0.1
XU4 N052 N044 N045 +4.5V -4.5V LT1818  ; pins In+ In- OUT V+ V-
R29 N044 N050 470 tol=1 pwr=0.1
R30 N052 N053 470 tol=1 pwr=0.1
C14 N045 N044 120p V=50 Irms=0 Rser=0 Lser=0 mfg="Murata" pn="GRM0335C1H121JA01" type="C0G"
R31 N045 N054 249 tol=1 pwr=0.1
R32 N054 0 10 tol=1 pwr=0.1
R33 LNA_OUT N051 100 tol=1 pwr=0.1
* U5: LT6232 (symbol Opamps\LT6232 not available, pins judged from their places): In+=0 In-=LNA_OUT V+=+4.5V V-=-4.5V OUT=N019
* U6: LT6232 (symbol Opamps\LT6232 not available, pins judged from their places): In+=N025 In-=N021 V+=+4.5V V-=-4.5V OUT=N021
R34 N019 LNA_OUT 500 tol=1 pwr=0.1
C17 N024 N019 4.7µ V=16 Irms=0 Rser=0 Lser=0 mfg="Murata" pn="GCM31CR71C475MA37" type="X7R"
C16 N025 N024 4.7µ V=16 Irms=0 Rser=0 Lser=0 mfg="Murata" pn="GCM31CR71C475MA37" type="X7R"
R35 N021 N024 2k
R36 N025 0 5k76
* U7: LT6232 (symbol Opamps\LT6232 not available, pins judged from their places): In+=0 In-=N017 V+=+4.5V V-=-4.5V OUT=N018
R37 N017 N021 100 tol=1 pwr=0.1
XU8 N018 N022 +4.5V -4.5V N022 LT1363  ; LT1364, pins In+ In- V+ V- OUT
R39 N023 0 49.9 tol=1 pwr=0.1
R38 N018 N017 2k
R40 N038 N018 1k69
R41 N039 N038 1k24
C1 N033 N038 120p
* U9: LT6232 (symbol Opamps\LT6232 not available, pins judged from their places): In+=N039 In-=N033 V+=+4.5V V-=-4.5V OUT=N033
C20 N039 0 100p
R42 N035 N033 4k02
R43 N036 N035 2k15
C21 N032 N035 150p
C22 N036 0 22p
R44 N034 0 49.9 tol=1 pwr=0.1
XU10 N036 N032 +4.5V -4.5V N032 LT1363  ; LT1364, pins In+ In- V+ V- OUT
R45 N048 N018 1k69
R46 N049 N048 1k24
C25 N042 N048 1200p
* U11: LT6232 (symbol Opamps\LT6232 not available, pins judged from their places): In+=N049 In-=N042 V+=+4.5V V-=-4.5V OUT=N042
C26 N049 0 1000p
R47 N046 N042 4k02
R48 N047 N046 2k15
C27 N041 N046 1500p
C28 N047 0 220p
R49 N043 0 49.9 tol=1 pwr=0.1
XU12 N047 N041 +4.5V -4.5V N041 LT1363  ; LT1364, pins In+ In- V+ V- OUT
C2 LNA_IN N016 330µ V=16 Irms=0.578 Rser=0.4 Lser=2n Rpar=500k
C4 LNA_IN N016 330µ V=16 Irms=0.578 Rser=0.4 Lser=2n Rpar=500k
C9 N029 N027 330µ V=16 Irms=0.578 Rser=0.4 Lser=2n Rpar=500k
C12 N012 N010 330µ V=16 Irms=0.578 Rser=0.4 Lser=2n Rpar=500k
C15 N051 N045 330µ V=16 Irms=0.578 Rser=0.4 Lser=2n Rpar=500k
C18 N043 N041 330µ V=16 Irms=0.578 Rser=0.4 Lser=2n Rpar=500k
C19 N043 N041 330µ V=16 Irms=0.578 Rser=0.4 Lser=2n Rpar=500k
C23 N034 N032 330µ V=16 Irms=0.578 Rser=0.4 Lser=2n Rpar=500k
C24 N034 N032 330µ V=16 Irms=0.578 Rser=0.4 Lser=2n Rpar=500k
C29 N023 N022 330µ V=16 Irms=0.578 Rser=0.4 Lser=2n Rpar=500k
C30 N023 N022 330µ V=16 Irms=0.578 Rser=0.4 Lser=2n Rpar=500k
.model NPN NPN
.model PNP PNP
.lib standard.bjt
.ac oct 20 1 1g
********************************************
* BCM847BS
* NXP Semiconductors
* Matched double NPN/NPN transistor
* IC   = 100 mA
* VCEO = 45 V
* hFE  = 200 - 450 @ 5V/2mA
* Package pinning does not match Spice model pinning.
* Package: SOT 363
* Package Pin 1;4: Emitter      TR1;TR2
* Package Pin 2;5: Base         TR1;TR2
* Package Pin 3;6: Collector    TR2;TR1
* Extraction date (week/year): 14/2006
* Simulator: Spice 2
********************************************
* Please note: The following model is to be used twice in
* schematic due to equality of both transistors.
*
.MODEL QBCM847BS NPN
+     IS = 1.822E-14
+     NF = 0.9932
+     ISE= 2.894E-16
+     NE = 1.4
+     BF = 324.4
+     IKF = 0.109
+     VAF = 82
+     NR = 0.9931
+     ISC = 9.982E-12
+     NC = 1.763
+     BR = 8.29
+     IKR = 0.09
+     VAR = 17.9
+     RB = 10
+     IRB = 5E-06
+     RBM = 5
+     RE = 0.649
+     RC = 0.7014
+     CJE = 1.244E-11
+     VJE = 0.7579
+     MJE = 0.3656
+     TF = 4.908E-10
+     XTF = 9.51
+     VTF = 2.927
+     ITF = 0.3131
+     PTF = 0
+     CJC = 3.347E-12
+     VJC = 0.5463
+     MJC = 0.391
+     XCJC = 0.6193
+     TR = 9E-08
+     CJS = 0
+     VJS = 0.75
+     MJS = 0.333
+     XTB = 0
+     XTI = 3
+     EG = 1.11
+     FC = 0.979
.param RLTP_H=2k2
.param RLTP_L=1k
.param CLTP=100p
* .step param RLTP_L 1500 3000 500
* .step param CLTP 100p 200p 100p
* 330uF - tantalum capacitor  TAJE337M016RNJ
.lib LTC2.lib
.lib LTC.lib
.backanno
.end